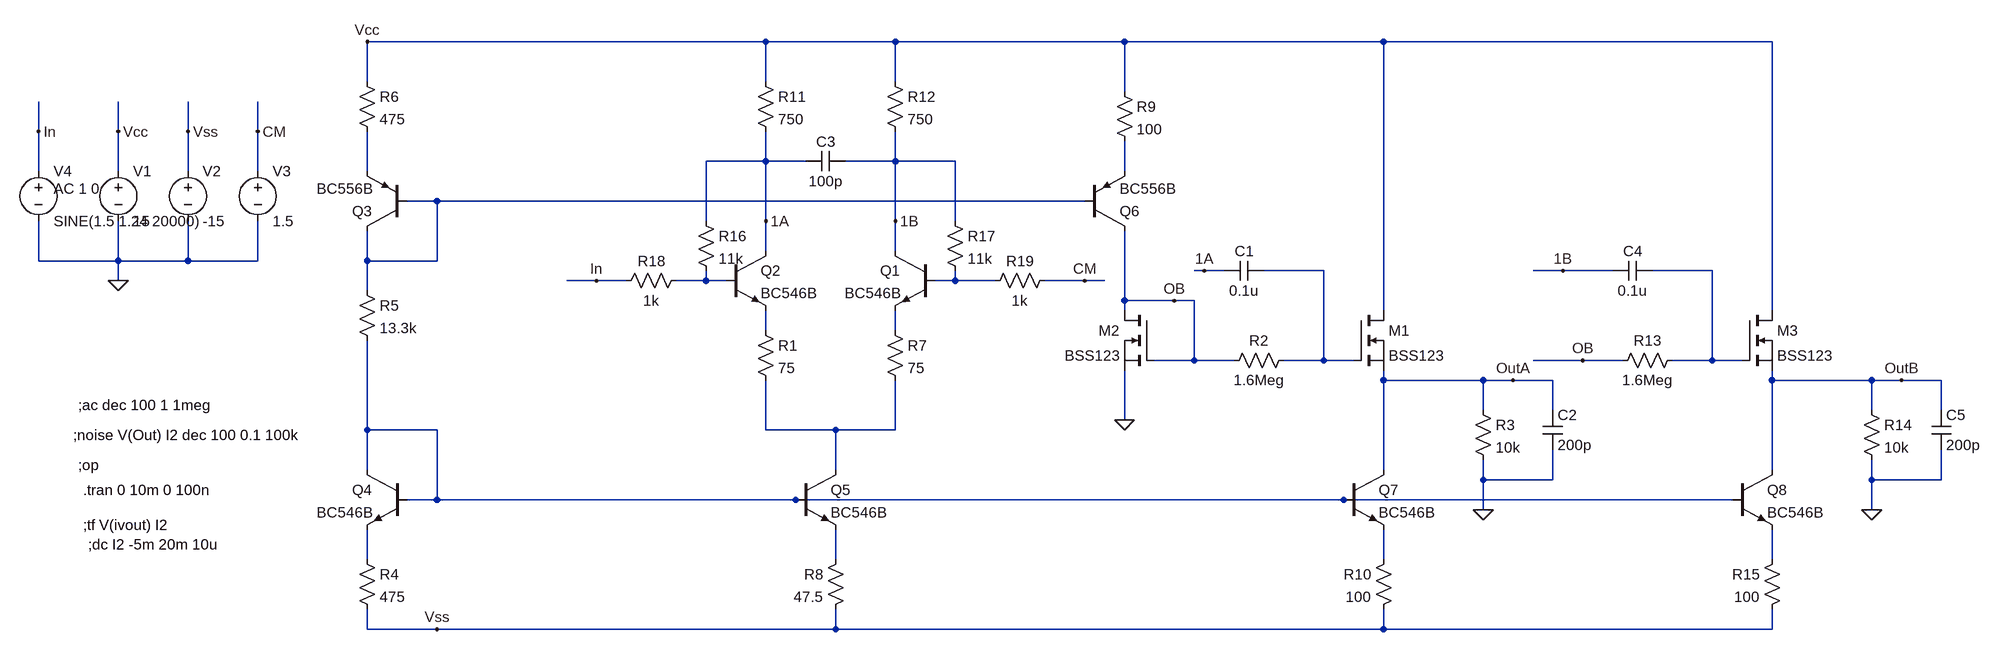
[diagram p0: schematic scaler1.asc]
scaler1.asc, the LTspice schematic file:
Version 4
SHEET 1 2488 1352
WIRE 528 -432 -112 -432
WIRE 736 -432 528 -432
WIRE 1104 -432 736 -432
WIRE 1520 -432 1104 -432
WIRE 2144 -432 1520 -432
WIRE -112 -368 -112 -432
WIRE 528 -368 528 -432
WIRE 736 -368 736 -432
WIRE 1104 -352 1104 -432
WIRE -640 -288 -640 -336
WIRE -512 -288 -512 -336
WIRE -400 -288 -400 -336
WIRE -288 -288 -288 -336
WIRE 528 -240 528 -288
WIRE 528 -240 432 -240
WIRE 592 -240 528 -240
WIRE 736 -240 736 -288
WIRE 736 -240 656 -240
WIRE 832 -240 736 -240
WIRE -640 -224 -640 -288
WIRE -512 -224 -512 -288
WIRE -400 -224 -400 -288
WIRE -288 -224 -288 -288
WIRE -112 -224 -112 -288
WIRE 1104 -224 1104 -272
WIRE 0 -176 -48 -176
WIRE 1040 -176 0 -176
WIRE 432 -144 432 -240
WIRE 528 -144 528 -240
WIRE 736 -144 736 -240
WIRE 832 -144 832 -240
WIRE 528 -96 528 -144
WIRE 736 -96 736 -144
WIRE -640 -80 -640 -144
WIRE -512 -80 -512 -144
WIRE -512 -80 -640 -80
WIRE -400 -80 -400 -144
WIRE -400 -80 -512 -80
WIRE -288 -80 -288 -144
WIRE -288 -80 -400 -80
WIRE -112 -80 -112 -128
WIRE 0 -80 0 -176
WIRE 0 -80 -112 -80
WIRE 1232 -64 1216 -64
WIRE 1264 -64 1232 -64
WIRE 1424 -64 1328 -64
WIRE 1808 -64 1760 -64
WIRE 1888 -64 1808 -64
WIRE 2048 -64 1952 -64
WIRE -512 -48 -512 -80
WIRE 256 -48 208 -48
WIRE 304 -48 256 -48
WIRE 432 -48 432 -64
WIRE 432 -48 384 -48
WIRE 464 -48 432 -48
WIRE 832 -48 832 -64
WIRE 832 -48 800 -48
WIRE 896 -48 832 -48
WIRE 1040 -48 976 -48
WIRE 1072 -48 1040 -48
WIRE -112 -32 -112 -80
WIRE 1104 -16 1104 -128
WIRE 1184 -16 1104 -16
WIRE 1216 -16 1184 -16
WIRE 1104 0 1104 -16
WIRE 1520 0 1520 -432
WIRE 2144 0 2144 -432
WIRE 528 32 528 0
WIRE 736 32 736 0
WIRE 1216 80 1216 -16
WIRE 1216 80 1152 80
WIRE 1280 80 1216 80
WIRE 1424 80 1424 -64
WIRE 1424 80 1360 80
WIRE 1472 80 1424 80
WIRE 1840 80 1760 80
WIRE 1904 80 1840 80
WIRE 2048 80 2048 -64
WIRE 2048 80 1984 80
WIRE 2096 80 2048 80
WIRE 1520 112 1520 96
WIRE 1680 112 1520 112
WIRE 1728 112 1680 112
WIRE 1792 112 1728 112
WIRE 2144 112 2144 96
WIRE 2304 112 2144 112
WIRE 2352 112 2304 112
WIRE 2416 112 2352 112
WIRE 1680 160 1680 112
WIRE 1792 160 1792 112
WIRE 2304 160 2304 112
WIRE 2416 160 2416 112
WIRE 1104 176 1104 96
WIRE -112 192 -112 48
WIRE 0 192 -112 192
WIRE 528 192 528 112
WIRE 640 192 528 192
WIRE 736 192 736 112
WIRE 736 192 640 192
WIRE -112 256 -112 192
WIRE 640 256 640 192
WIRE 1520 256 1520 112
WIRE 2144 256 2144 112
WIRE 1680 272 1680 240
WIRE 1792 272 1792 224
WIRE 1792 272 1680 272
WIRE 2304 272 2304 240
WIRE 2416 272 2416 224
WIRE 2416 272 2304 272
WIRE 0 304 0 192
WIRE 0 304 -48 304
WIRE 576 304 0 304
WIRE 1456 304 576 304
WIRE 2080 304 1456 304
WIRE 1680 320 1680 272
WIRE 2304 320 2304 272
WIRE -112 400 -112 352
WIRE 640 400 640 352
WIRE 1520 400 1520 352
WIRE 2144 400 2144 352
WIRE -112 512 -112 480
WIRE 0 512 -112 512
WIRE 640 512 640 480
WIRE 640 512 0 512
WIRE 1520 512 1520 480
WIRE 1520 512 640 512
WIRE 2144 512 2144 480
WIRE 2144 512 1520 512
FLAG -512 -48 0
FLAG -512 -288 Vcc
FLAG -400 -288 Vss
FLAG -112 -432 Vcc
FLAG 1680 320 0
FLAG 1728 112 OutA
FLAG 1104 176 0
FLAG 0 512 Vss
FLAG 1040 -48 CM
FLAG -288 -288 CM
FLAG 256 -48 In
FLAG -640 -288 In
FLAG 2304 320 0
FLAG 2352 112 OutB
FLAG 528 -144 1A
FLAG 736 -144 1B
FLAG 1184 -16 OB
FLAG 1840 80 OB
FLAG 1232 -64 1A
FLAG 1808 -64 1B
SYMBOL voltage -512 -240 R0
WINDOW 123 0 0 Left 0
WINDOW 39 0 0 Left 0
SYMATTR InstName V1
SYMATTR Value 15
SYMBOL voltage -400 -240 R0
WINDOW 123 0 0 Left 0
WINDOW 39 0 0 Left 0
SYMATTR InstName V2
SYMATTR Value -15
SYMBOL nmos 1472 0 R0
SYMATTR InstName M1
SYMATTR Value BSS123
SYMBOL nmos 1152 0 M0
SYMATTR InstName M2
SYMATTR Value BSS123
SYMBOL res 1376 64 R90
WINDOW 0 0 56 VBottom 0
WINDOW 3 32 56 VTop 0
SYMATTR InstName R2
SYMATTR Value 1.6Meg
SYMBOL cap 1328 -80 R90
WINDOW 0 0 32 VBottom 0
WINDOW 3 32 32 VTop 0
SYMATTR InstName C1
SYMATTR Value 0.1u
SYMBOL res 1664 144 R0
SYMATTR InstName R3
SYMATTR Value 10k
SYMBOL cap 1776 160 R0
SYMATTR InstName C2
SYMATTR Value 200p
SYMBOL npn 464 -96 R0
SYMATTR InstName Q2
SYMATTR Value BC546B
SYMBOL res -128 384 R0
SYMATTR InstName R4
SYMATTR Value 475
SYMBOL res -128 -48 R0
SYMATTR InstName R5
SYMATTR Value 13.3k
SYMBOL pnp -48 -128 R180
SYMATTR InstName Q3
SYMATTR Value BC556B
SYMBOL res -128 -384 R0
SYMATTR InstName R6
SYMATTR Value 475
SYMBOL npn 576 256 R0
SYMATTR InstName Q5
SYMATTR Value BC546B
SYMBOL res 656 384 M0
SYMATTR InstName R8
SYMATTR Value 47.5
SYMBOL res 1088 -368 R0
SYMATTR InstName R9
SYMATTR Value 100
SYMBOL pnp 1040 -128 M180
SYMATTR InstName Q6
SYMATTR Value BC556B
SYMBOL npn 1456 256 R0
SYMATTR InstName Q7
SYMATTR Value BC546B
SYMBOL res 1536 384 M0
SYMATTR InstName R10
SYMATTR Value 100
SYMBOL npn 800 -96 M0
SYMATTR InstName Q1
SYMATTR Value BC546B
SYMBOL res 512 16 R0
SYMATTR InstName R1
SYMATTR Value 75
SYMBOL res 720 16 R0
SYMATTR InstName R7
SYMATTR Value 75
SYMBOL res 512 -384 R0
SYMATTR InstName R11
SYMATTR Value 750
SYMBOL res 720 -384 R0
SYMATTR InstName R12
SYMATTR Value 750
SYMBOL cap 656 -256 R90
WINDOW 0 0 32 VBottom 0
WINDOW 3 32 32 VTop 0
SYMATTR InstName C3
SYMATTR Value 100p
SYMBOL voltage -288 -240 R0
WINDOW 123 0 0 Left 0
WINDOW 39 0 0 Left 0
SYMATTR InstName V3
SYMATTR Value 1.5
SYMBOL npn -48 256 M0
SYMATTR InstName Q4
SYMATTR Value BC546B
SYMBOL voltage -640 -240 R0
WINDOW 123 24 44 Left 0
WINDOW 39 0 0 Left 0
SYMATTR Value2 AC 1 0
SYMATTR InstName V4
SYMATTR Value SINE(1.5 1.24 20000)
SYMBOL nmos 2096 0 R0
SYMATTR InstName M3
SYMATTR Value BSS123
SYMBOL res 2000 64 R90
WINDOW 0 0 56 VBottom 0
WINDOW 3 32 56 VTop 0
SYMATTR InstName R13
SYMATTR Value 1.6Meg
SYMBOL cap 1952 -80 R90
WINDOW 0 0 32 VBottom 0
WINDOW 3 32 32 VTop 0
SYMATTR InstName C4
SYMATTR Value 0.1u
SYMBOL res 2288 144 R0
SYMATTR InstName R14
SYMATTR Value 10k
SYMBOL cap 2400 160 R0
SYMATTR InstName C5
SYMATTR Value 200p
SYMBOL npn 2080 256 R0
SYMATTR InstName Q8
SYMATTR Value BC546B
SYMBOL res 2160 384 M0
SYMATTR InstName R15
SYMATTR Value 100
SYMBOL res 400 -64 R90
WINDOW 0 0 56 VBottom 0
WINDOW 3 32 56 VTop 0
SYMATTR InstName R18
SYMATTR Value 1k
SYMBOL res 992 -64 R90
WINDOW 0 0 56 VBottom 0
WINDOW 3 32 56 VTop 0
SYMATTR InstName R19
SYMATTR Value 1k
SYMBOL res 416 -160 R0
SYMATTR InstName R16
SYMATTR Value 11k
SYMBOL res 816 -160 R0
SYMATTR InstName R17
SYMATTR Value 11k
TEXT -568 288 Left 0 !.tran 0 10m 0 100n
TEXT -576 248 Left 0 !;op
TEXT -584 200 Left 0 !;noise V(Out) I2 dec 100 0.1 100k
TEXT -576 152 Left 0 !;ac dec 100 1 1meg
TEXT -568 344 Left 0 !;tf V(ivout) I2
TEXT -560 376 Left 0 !;dc I2 -5m 20m 10u

The netlist it stands for:
* scaler1.asc
V1 Vcc 0 15
V2 Vss 0 -15
M1 Vcc N004 OutA OutA BSS123
M2 OB OB 0 0 BSS123
R2 N004 OB 1.6Meg
C1 N004 1A 0.1u
R3 OutA 0 10k
C2 OutA 0 200p
Q2 1A N006 N008 0 BC546B
R4 N012 Vss 475
R5 N003 N010 13.3k
Q3 N003 N003 N001 0 BC556B
R6 Vcc N001 475
Q5 N011 N010 N013 0 BC546B
R8 N013 Vss 47.5
R9 Vcc N002 100
Q6 OB N003 N002 0 BC556B
Q7 OutA N010 N014 0 BC546B
R10 N014 Vss 100
Q1 1B N007 N009 0 BC546B
R1 N008 N011 75
R7 N009 N011 75
R11 Vcc 1A 750
R12 Vcc 1B 750
C3 1B 1A 100p
V3 CM 0 1.5
Q4 N010 N010 N012 0 BC546B
V4 In 0 SINE(1.5 1.24 20000) AC 1 0
M3 Vcc N005 OutB OutB BSS123
R13 N005 OB 1.6Meg
C4 N005 1B 0.1u
R14 OutB 0 10k
C5 OutB 0 200p
Q8 OutB N010 N015 0 BC546B
R15 N015 Vss 100
R18 N006 In 1k
R19 CM N007 1k
R16 1A N006 11k
R17 1B N007 11k
.model NPN NPN
.model PNP PNP
.lib standard.bjt
.model NMOS NMOS
.model PMOS PMOS
.lib standard.mos
.tran 0 10m 0 100n
;op
;noise V(Out) I2 dec 100 0.1 100k
;ac dec 100 1 1meg
;tf V(ivout) I2
;dc I2 -5m 20m 10u
.backanno
.end